# Altium schematic sheet Connector_1.SchDoc
size A2; Date: Date; CompanyName: HESSO; Engineer: Name; Address1: Route du Rawyl 47; Address2: 1950 Sion; Address3: Switzerland; DocumentNumber: 2; SheetNumber: 2; SheetTotal: 3; ProjectName: Project Name
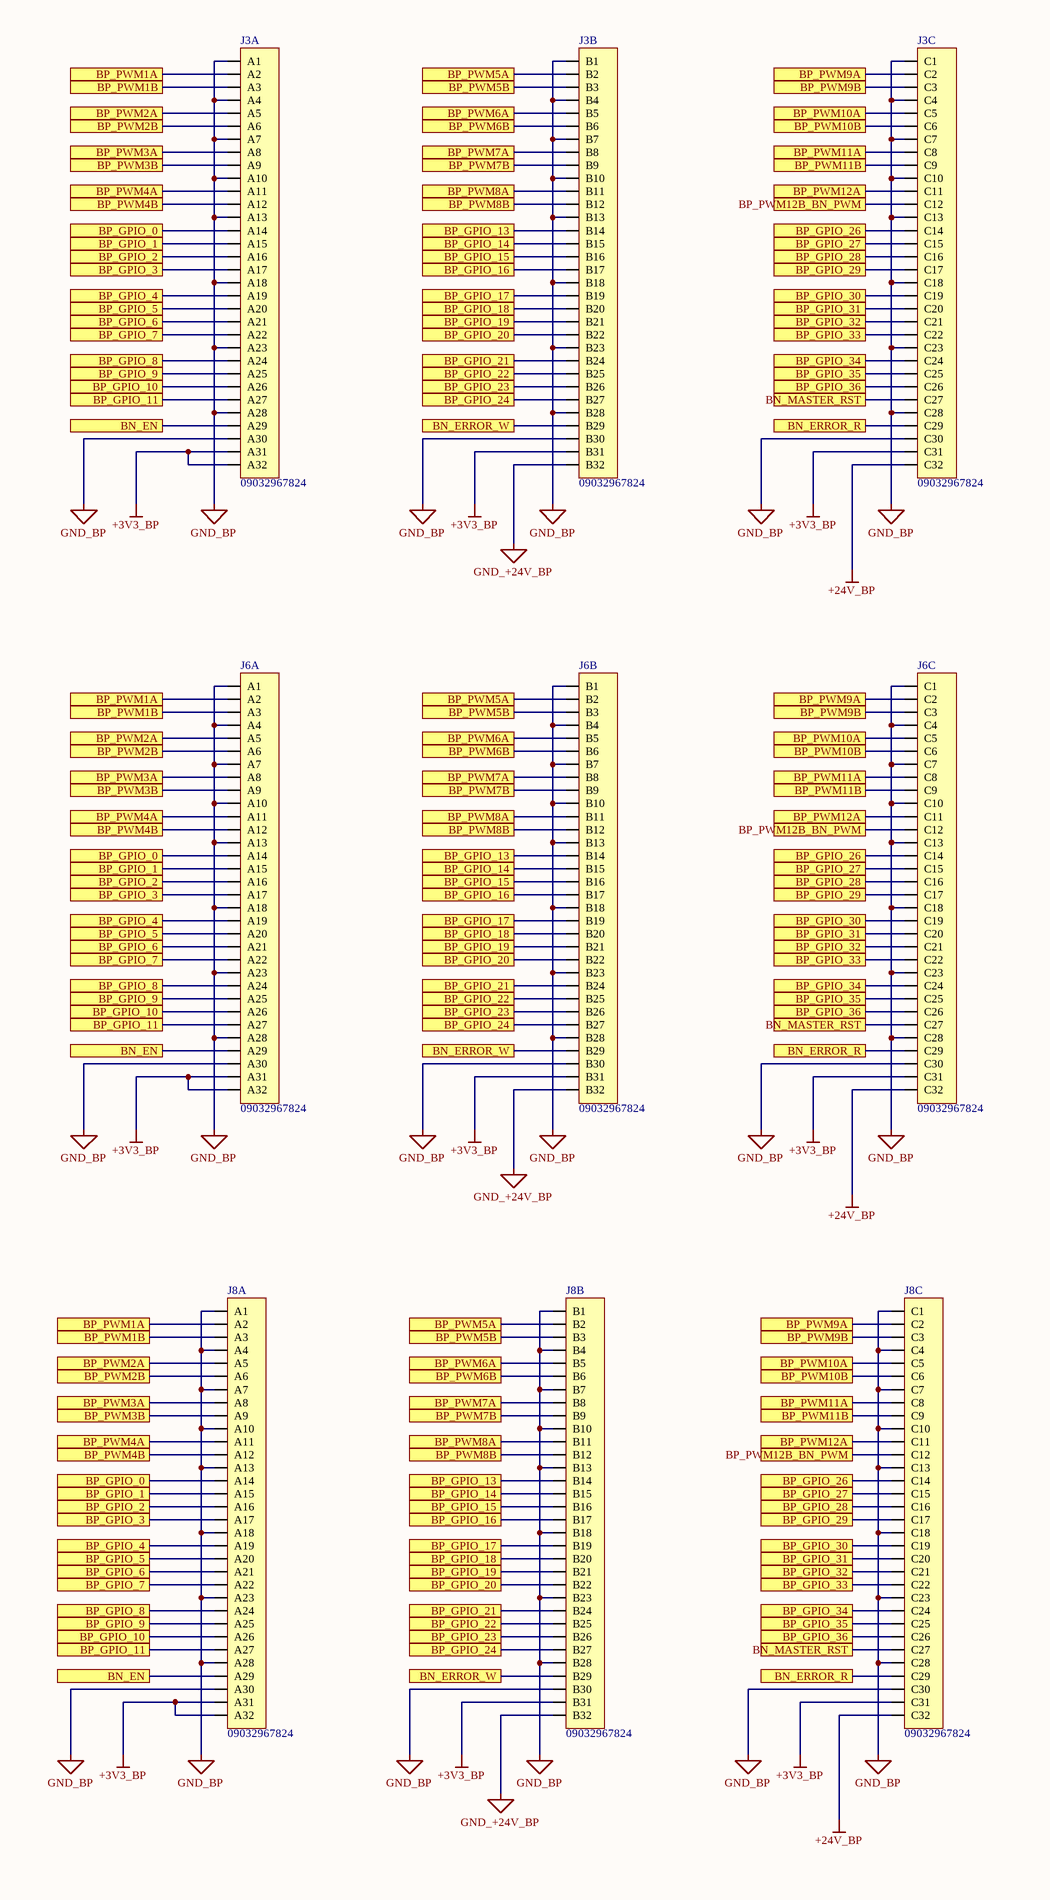
[diagram p0: Connector_1.SchDoc, left]
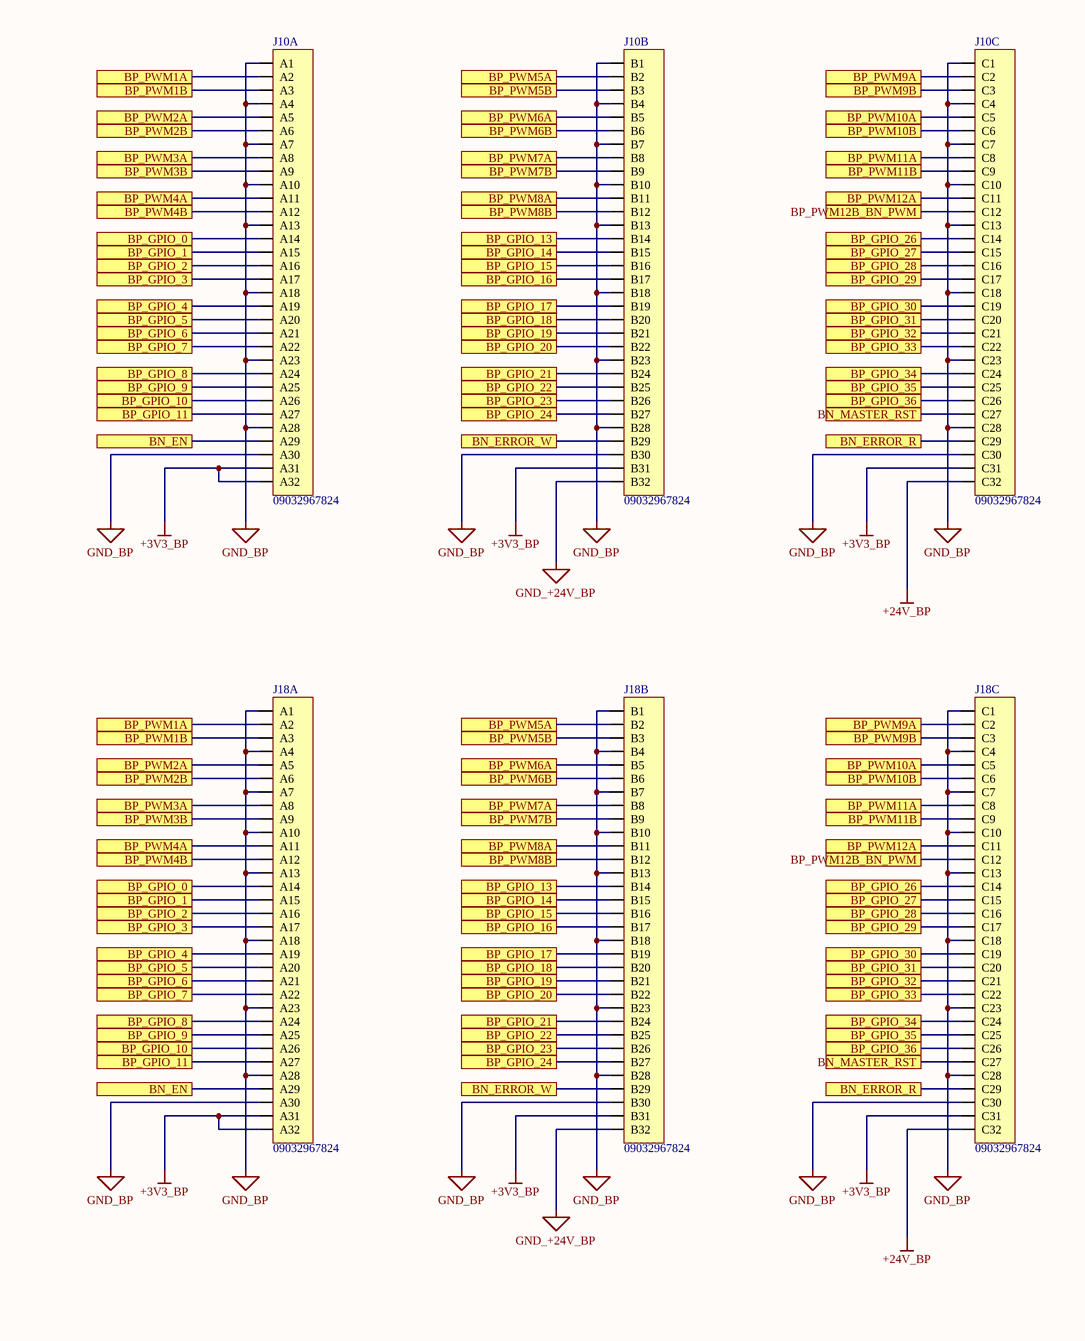
[diagram p1: Connector_1.SchDoc, right]

## Parts
J3  09032967824  [DIN41612 FEM 3x32 ABC Straight]  (parts A,B,C of 3)
J6  09032967824  [DIN41612 FEM 3x32 ABC Straight]  (parts A,B,C of 3)
J8  09032967824  [DIN41612 FEM 3x32 ABC Straight]  (parts A,B,C of 3)
J10  09032967824  [DIN41612 FEM 3x32 ABC Straight]  (parts A,B,C of 3)
J18  09032967824  [DIN41612 FEM 3x32 ABC Straight]  (parts A,B,C of 3)

## Ports
BN_EN, BN_ERROR_R, BN_ERROR_W, BN_MASTER_RST, BP_GPIO_0, BP_GPIO_1, BP_GPIO_2, BP_GPIO_3, BP_GPIO_4, BP_GPIO_5, BP_GPIO_6, BP_GPIO_7, BP_GPIO_8, BP_GPIO_9, BP_GPIO_10, BP_GPIO_11, BP_GPIO_13, BP_GPIO_14, BP_GPIO_15, BP_GPIO_16, BP_GPIO_17, BP_GPIO_18, BP_GPIO_19, BP_GPIO_20, BP_GPIO_21, BP_GPIO_22, BP_GPIO_23, BP_GPIO_24, BP_GPIO_26, BP_GPIO_27, BP_GPIO_28, BP_GPIO_29, BP_GPIO_30, BP_GPIO_31, BP_GPIO_32, BP_GPIO_33, BP_GPIO_34, BP_GPIO_35, BP_GPIO_36, BP_PWM1A, BP_PWM1B, BP_PWM2A, BP_PWM2B, BP_PWM3A, BP_PWM3B, BP_PWM4A, BP_PWM4B, BP_PWM5A, BP_PWM5B, BP_PWM6A, BP_PWM6B, BP_PWM7A, BP_PWM7B, BP_PWM8A, BP_PWM8B, BP_PWM9A, BP_PWM9B, BP_PWM10A, BP_PWM10B, BP_PWM11A, BP_PWM11B, BP_PWM12A, BP_PWM12B_BN_PWM

## Nets
+3V3_BP: J3.A31 J3.A32 J3.B31 J3.C31 J6.A31 J6.A32 J6.B31 J6.C31 J8.A31 J8.A32 J8.B31 J8.C31 J10.A31 J10.A32 J10.B31 J10.C31 J18.A31 J18.A32 J18.B31 J18.C31
+24V_BP: J3.C32 J6.C32 J8.C32 J10.C32 J18.C32
GND_+24V_BP: J3.B32 J6.B32 J8.B32 J10.B32 J18.B32
GND_BP: J3.A1 J3.A4 J3.A7 J3.A10 J3.A13 J3.A18 J3.A23 J3.A28 J3.A30 J3.B1 J3.B4 J3.B7 J3.B10 J3.B13 J3.B18 J3.B23 J3.B28 J3.B30 J3.C1 J3.C4 J3.C7 J3.C10 J3.C13 J3.C18 J3.C23 J3.C28 J3.C30 J6.A1 J6.A4 J6.A7 J6.A10 J6.A13 J6.A18 J6.A23 J6.A28 J6.A30 J6.B1 J6.B4 J6.B7 J6.B10 J6.B13 J6.B18 J6.B23 J6.B28 J6.B30 J6.C1 J6.C4 J6.C7 J6.C10 J6.C13 J6.C18 J6.C23 J6.C28 J6.C30 J8.A1 J8.A4 J8.A7 J8.A10 J8.A13 J8.A18 J8.A23 J8.A28 J8.A30 J8.B1 J8.B4 J8.B7 J8.B10 J8.B13 J8.B18 J8.B23 J8.B28 J8.B30 J8.C1 J8.C4 J8.C7 J8.C10 J8.C13 J8.C18 J8.C23 J8.C28 J8.C30 J10.A1 J10.A4 J10.A7 J10.A10 J10.A13 J10.A18 J10.A23 J10.A28 J10.A30 J10.B1 J10.B4 J10.B7 J10.B10 J10.B13 J10.B18 J10.B23 J10.B28 J10.B30 J10.C1 J10.C4 J10.C7 J10.C10 J10.C13 J10.C18 J10.C23 J10.C28 J10.C30 J18.A1 J18.A4 J18.A7 J18.A10 J18.A13 J18.A18 J18.A23 J18.A28 J18.A30 J18.B1 J18.B4 J18.B7 J18.B10 J18.B13 J18.B18 J18.B23 J18.B28 J18.B30 J18.C1 J18.C4 J18.C7 J18.C10 J18.C13 J18.C18 J18.C23 J18.C28 J18.C30
BN_EN: J3.A29 J6.A29 J8.A29 J10.A29 J18.A29 ; port BN_EN
BN_ERROR_R: J3.C29 J6.C29 J8.C29 J10.C29 J18.C29 ; port BN_ERROR_R
BN_ERROR_W: J3.B29 J6.B29 J8.B29 J10.B29 J18.B29 ; port BN_ERROR_W
BN_MASTER_RST: J3.C27 J6.C27 J8.C27 J10.C27 J18.C27 ; port BN_MASTER_RST
BP_GPIO_0: J3.A14 J6.A14 J8.A14 J10.A14 J18.A14 ; port BP_GPIO_0
BP_GPIO_1: J3.A15 J6.A15 J8.A15 J10.A15 J18.A15 ; port BP_GPIO_1
BP_GPIO_2: J3.A16 J6.A16 J8.A16 J10.A16 J18.A16 ; port BP_GPIO_2
BP_GPIO_3: J3.A17 J6.A17 J8.A17 J10.A17 J18.A17 ; port BP_GPIO_3
BP_GPIO_4: J3.A19 J6.A19 J8.A19 J10.A19 J18.A19 ; port BP_GPIO_4
BP_GPIO_5: J3.A20 J6.A20 J8.A20 J10.A20 J18.A20 ; port BP_GPIO_5
BP_GPIO_6: J3.A21 J6.A21 J8.A21 J10.A21 J18.A21 ; port BP_GPIO_6
BP_GPIO_7: J3.A22 J6.A22 J8.A22 J10.A22 J18.A22 ; port BP_GPIO_7
BP_GPIO_8: J3.A24 J6.A24 J8.A24 J10.A24 J18.A24 ; port BP_GPIO_8
BP_GPIO_9: J3.A25 J6.A25 J8.A25 J10.A25 J18.A25 ; port BP_GPIO_9
BP_GPIO_10: J3.A26 J6.A26 J8.A26 J10.A26 J18.A26 ; port BP_GPIO_10
BP_GPIO_11: J3.A27 J6.A27 J8.A27 J10.A27 J18.A27 ; port BP_GPIO_11
BP_GPIO_13: J3.B14 J6.B14 J8.B14 J10.B14 J18.B14 ; port BP_GPIO_13
BP_GPIO_14: J3.B15 J6.B15 J8.B15 J10.B15 J18.B15 ; port BP_GPIO_14
BP_GPIO_15: J3.B16 J6.B16 J8.B16 J10.B16 J18.B16 ; port BP_GPIO_15
BP_GPIO_16: J3.B17 J6.B17 J8.B17 J10.B17 J18.B17 ; port BP_GPIO_16
BP_GPIO_17: J3.B19 J6.B19 J8.B19 J10.B19 J18.B19 ; port BP_GPIO_17
BP_GPIO_18: J3.B20 J6.B20 J8.B20 J10.B20 J18.B20 ; port BP_GPIO_18
BP_GPIO_19: J3.B21 J6.B21 J8.B21 J10.B21 J18.B21 ; port BP_GPIO_19
BP_GPIO_20: J3.B22 J6.B22 J8.B22 J10.B22 J18.B22 ; port BP_GPIO_20
BP_GPIO_21: J3.B24 J6.B24 J8.B24 J10.B24 J18.B24 ; port BP_GPIO_21
BP_GPIO_22: J3.B25 J6.B25 J8.B25 J10.B25 J18.B25 ; port BP_GPIO_22
BP_GPIO_23: J3.B26 J6.B26 J8.B26 J10.B26 J18.B26 ; port BP_GPIO_23
BP_GPIO_24: J3.B27 J6.B27 J8.B27 J10.B27 J18.B27 ; port BP_GPIO_24
BP_GPIO_26: J3.C14 J6.C14 J8.C14 J10.C14 J18.C14 ; port BP_GPIO_26
BP_GPIO_27: J3.C15 J6.C15 J8.C15 J10.C15 J18.C15 ; port BP_GPIO_27
BP_GPIO_28: J3.C16 J6.C16 J8.C16 J10.C16 J18.C16 ; port BP_GPIO_28
BP_GPIO_29: J3.C17 J6.C17 J8.C17 J10.C17 J18.C17 ; port BP_GPIO_29
BP_GPIO_30: J3.C19 J6.C19 J8.C19 J10.C19 J18.C19 ; port BP_GPIO_30
BP_GPIO_31: J3.C20 J6.C20 J8.C20 J10.C20 J18.C20 ; port BP_GPIO_31
BP_GPIO_32: J3.C21 J6.C21 J8.C21 J10.C21 J18.C21 ; port BP_GPIO_32
BP_GPIO_33: J3.C22 J6.C22 J8.C22 J10.C22 J18.C22 ; port BP_GPIO_33
BP_GPIO_34: J3.C24 J6.C24 J8.C24 J10.C24 J18.C24 ; port BP_GPIO_34
BP_GPIO_35: J3.C25 J6.C25 J8.C25 J10.C25 J18.C25 ; port BP_GPIO_35
BP_GPIO_36: J3.C26 J6.C26 J8.C26 J10.C26 J18.C26 ; port BP_GPIO_36
BP_PWM1A: J3.A2 J6.A2 J8.A2 J10.A2 J18.A2 ; port BP_PWM1A
BP_PWM1B: J3.A3 J6.A3 J8.A3 J10.A3 J18.A3 ; port BP_PWM1B
BP_PWM2A: J3.A5 J6.A5 J8.A5 J10.A5 J18.A5 ; port BP_PWM2A
BP_PWM2B: J3.A6 J6.A6 J8.A6 J10.A6 J18.A6 ; port BP_PWM2B
BP_PWM3A: J3.A8 J6.A8 J8.A8 J10.A8 J18.A8 ; port BP_PWM3A
BP_PWM3B: J3.A9 J6.A9 J8.A9 J10.A9 J18.A9 ; port BP_PWM3B
BP_PWM4A: J3.A11 J6.A11 J8.A11 J10.A11 J18.A11 ; port BP_PWM4A
BP_PWM4B: J3.A12 J6.A12 J8.A12 J10.A12 J18.A12 ; port BP_PWM4B
BP_PWM5A: J3.B2 J6.B2 J8.B2 J10.B2 J18.B2 ; port BP_PWM5A
BP_PWM5B: J3.B3 J6.B3 J8.B3 J10.B3 J18.B3 ; port BP_PWM5B
BP_PWM6A: J3.B5 J6.B5 J8.B5 J10.B5 J18.B5 ; port BP_PWM6A
BP_PWM6B: J3.B6 J6.B6 J8.B6 J10.B6 J18.B6 ; port BP_PWM6B
BP_PWM7A: J3.B8 J6.B8 J8.B8 J10.B8 J18.B8 ; port BP_PWM7A
BP_PWM7B: J3.B9 J6.B9 J8.B9 J10.B9 J18.B9 ; port BP_PWM7B
BP_PWM8A: J3.B11 J6.B11 J8.B11 J10.B11 J18.B11 ; port BP_PWM8A
BP_PWM8B: J3.B12 J6.B12 J8.B12 J10.B12 J18.B12 ; port BP_PWM8B
BP_PWM9A: J3.C2 J6.C2 J8.C2 J10.C2 J18.C2 ; port BP_PWM9A
BP_PWM9B: J3.C3 J6.C3 J8.C3 J10.C3 J18.C3 ; port BP_PWM9B
BP_PWM10A: J3.C5 J6.C5 J8.C5 J10.C5 J18.C5 ; port BP_PWM10A
BP_PWM10B: J3.C6 J6.C6 J8.C6 J10.C6 J18.C6 ; port BP_PWM10B
BP_PWM11A: J3.C8 J6.C8 J8.C8 J10.C8 J18.C8 ; port BP_PWM11A
BP_PWM11B: J3.C9 J6.C9 J8.C9 J10.C9 J18.C9 ; port BP_PWM11B
BP_PWM12A: J3.C11 J6.C11 J8.C11 J10.C11 J18.C11 ; port BP_PWM12A
BP_PWM12B_BN_PWM: J3.C12 J6.C12 J8.C12 J10.C12 J18.C12 ; port BP_PWM12B_BN_PWM

## Notes on the sheet
- Date :
- Revision :
- Sheet
- of
- Design by :

## Library data of the parts
J3 J6 J8 J10 J18 = DIN41612 FEM 3X32 STRAIGHT: DIN41612 FEM 3X32 ABC STRAIGHT; Manufacturer: Harting; Mouser No.: 617-09032967824; Value: 09032967824